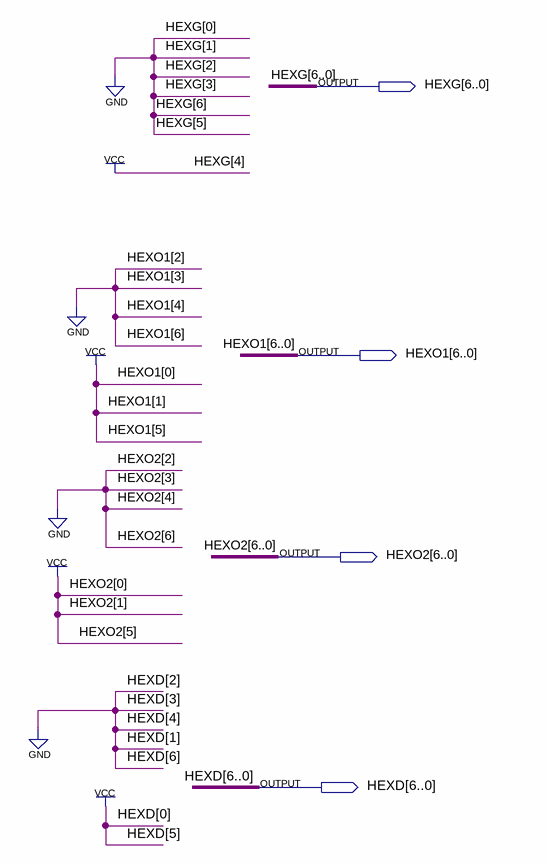
[diagram p0: schematic sheet]
// Quartus schematic Good.bdf as structural Verilog: 0 symbols, 4 pins
module Good (
  output [6:0] HEXG,
  output [6:0] HEXO1,
  output [6:0] HEXO2,
  output [6:0] HEXD
);


  assign HEXD = 7'b0100001;
  assign HEXG = 7'b0010000;
  assign HEXO1 = 7'b0100011;
  assign HEXO2 = 7'b0100011;
endmodule
